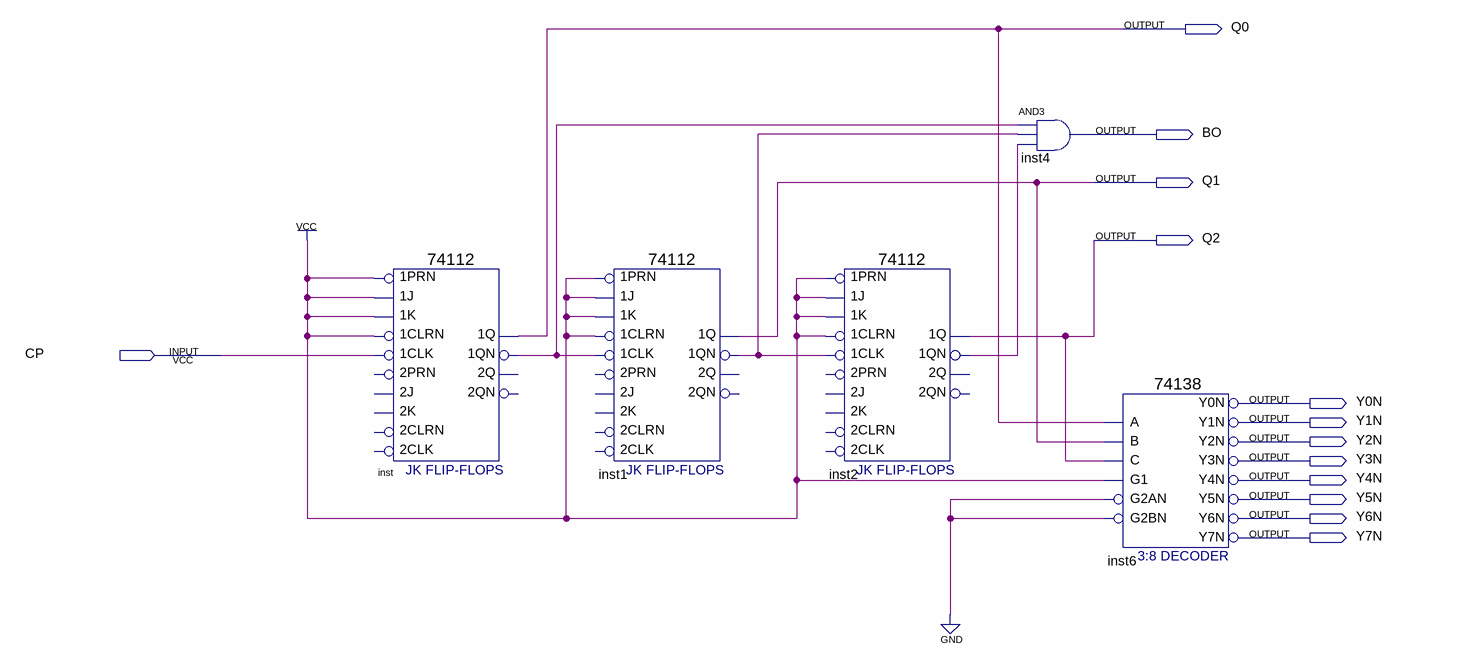
[diagram p0: schematic sheet]
// Quartus schematic THR2023063114.bdf as structural Verilog: 5 symbols, 13 pins
module THR2023063114 (
  input  CP,
  output Q0,
  output BO,
  output Q1,
  output Q2,
  output Y0N,
  output Y1N,
  output Y2N,
  output Y3N,
  output Y4N,
  output Y5N,
  output Y6N,
  output Y7N
);

  wire inst1_1qn, inst2_1qn, inst_1qn;

  \74112  inst (
    .\1K (1'b1), .\1J (1'b1), .\1PRN (1'b1), .\1CLK (CP), .\1CLRN (1'b1), .\1QN (inst_1qn), .\1Q (Q0));  // open: 2K, 2J, 2PRN, 2CLK, 2CLRN, 2Q, 2QN
  \74112  inst1 (
    .\1K (1'b1), .\1J (1'b1), .\1PRN (1'b1), .\1CLK (inst_1qn), .\1CLRN (1'b1), .\1QN (inst1_1qn), .\1Q (Q1));  // open: 2K, 2J, 2PRN, 2CLK, 2CLRN, 2Q, 2QN
  \74112  inst2 (
    .\1K (1'b1), .\1J (1'b1), .\1PRN (1'b1), .\1CLK (inst1_1qn), .\1CLRN (1'b1), .\1QN (inst2_1qn), .\1Q (Q2));  // open: 2K, 2J, 2PRN, 2CLK, 2CLRN, 2Q, 2QN
  and inst4 (BO, inst_1qn, inst1_1qn, inst2_1qn);
  \74138  inst6 (
    .A(Q0), .B(Q1), .G1(1'b1), .C(Q2), .G2AN(1'b0), .G2BN(1'b0), .Y0N(Y0N), .Y1N(Y1N), .Y2N(Y2N), .Y3N(Y3N),
    .Y4N(Y4N), .Y5N(Y5N), .Y6N(Y6N), .Y7N(Y7N));
endmodule
